# Altium schematic sheet NodemcuShield_Light_Temp_LCD.SchDoc
size A4
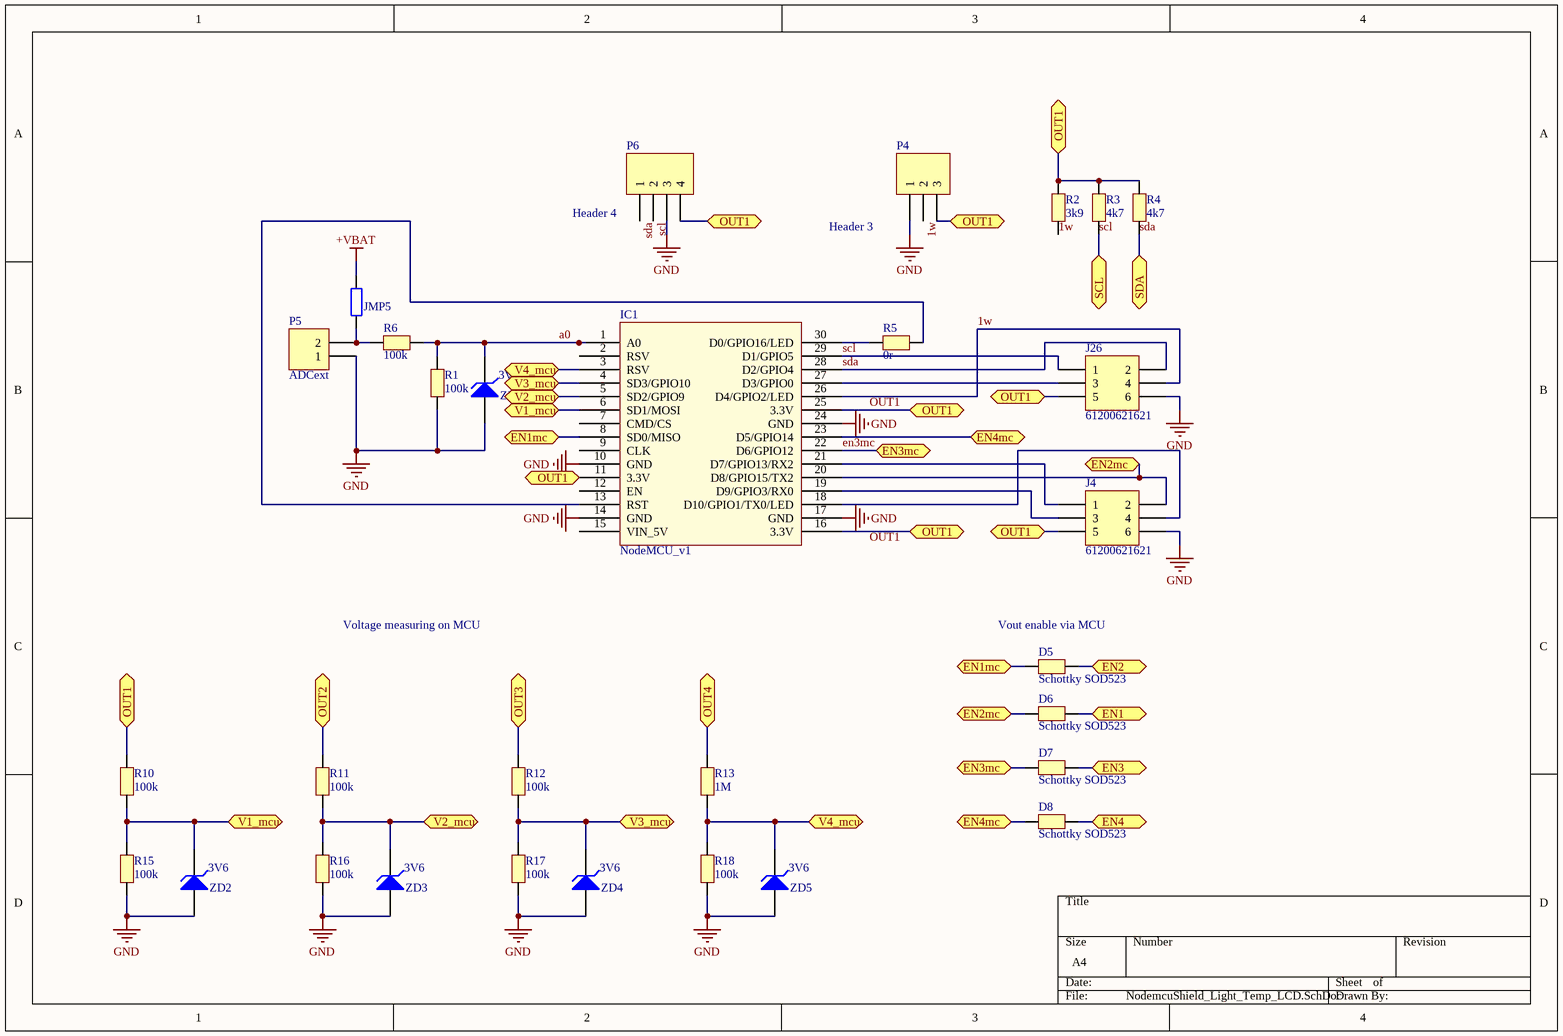
[diagram p0: NodemcuShield_Light_Temp_LCD.SchDoc]

## Parts
D5  Schottky SOD523  [SOD523]
D6  Schottky SOD523  [SOD523]
D7  Schottky SOD523  [SOD523]
D8  Schottky SOD523  [SOD523]
IC1  NodeMCU_v1  [Nodemcu]
J4  61200621621  [61200621621]
J26  61200621621  [61200621621]
JMP5  Resistor generic  [0603 RES]  (value not drawn)
P4  Header 3  [HDR1X3]
P5  ADCext  [HDR1X2]
P6  Header 4  [HDR1X4]
R1  100k  [0603 RES]
R2  3k9  [0603 RES]
R3  4k7  [0603 RES]
R4  4k7  [0603 RES]
R5  0r  [0603 RES]
R6  100k  [0603 RES]
R10  100k  [0603 RES]
R11  100k  [0603 RES]
R12  100k  [0603 RES]
R13  1M  [0603 RES]
R15  100k  [0603 RES]
R16  100k  [0603 RES]
R17  100k  [0603 RES]
R18  100k  [0603 RES]
ZD1  Valve: 3V6  [MELF_diode]  (hidden comment: Diode Zener)
ZD2  Valve: 3V6  [MELF_diode]  (hidden comment: Diode Zener)
ZD3  Valve: 3V6  [MELF_diode]  (hidden comment: Diode Zener)
ZD4  Valve: 3V6  [MELF_diode]  (hidden comment: Diode Zener)
ZD5  Valve: 3V6  [MELF_diode]  (hidden comment: Diode Zener)

## Ports
EN1, EN1mc, EN2, EN2mc, EN3, EN3mc, EN4, EN4mc, OUT1, OUT2, OUT3, OUT4, SCL, SDA, V1_mcu, V2_mcu, V3_mcu, V4_mcu

## Nets
+VBAT: JMP5.2
GND: IC1.10(GND) IC1.14(GND) IC1.17(GND) IC1.24(GND) J4.6 J26.6 P4.1 P5.1 P6.3 R1.2 R15.2 R16.2 R17.2 R18.2 ZD1.1(A) ZD2.1(A) ZD3.1(A) ZD4.1(A) ZD5.1(A)
1w: IC1.26(D4/GPIO2/LED) J26.4 P4.2 R2.1
a0: IC1.1(A0) R1.1 R6.1 ZD1.2(K)
EN1: D6.1 ; port EN1
EN1mc: D5.2 IC1.8(SD0/MISO) ; port EN1mc
EN2: D5.1 ; port EN2
EN2mc: D6.2 IC1.20(D8/GPIO15/TX2) J4.2 ; port EN2mc
EN3: D7.1 ; port EN3
en3mc: D7.2 IC1.22(D6/GPIO12) ; port EN3mc
EN4: D8.1 ; port EN4
EN4mc: D8.2 IC1.23(D5/GPIO14) ; port EN4mc
OUT1: IC1.11(3.3V) IC1.16(3.3V) IC1.25(3.3V) J4.5 J26.5 P4.3 P6.4 R2.2 R3.2 R4.2 R10.1 ; port OUT1
OUT2: R11.1 ; port OUT2
OUT3: R12.1 ; port OUT3
OUT4: R13.1 ; port OUT4
scl: IC1.29(D1/GPIO5) J26.1 P6.2 R3.1 ; port SCL
sda: IC1.28(D2/GPIO4) J26.2 P6.1 R4.1 ; port SDA
V1_mcu: IC1.6(SD1/MOSI) R10.2 R15.1 ZD2.2(K) ; port V1_mcu
V2_mcu: IC1.5(SD2/GPIO9) R11.2 R16.1 ZD3.2(K) ; port V2_mcu
V3_mcu: IC1.4(SD3/GPIO10) R12.2 R17.1 ZD4.2(K) ; port V3_mcu
V4_mcu: IC1.3(RSV) R13.2 R18.1 ZD5.2(K) ; port V4_mcu
NetIC1_13: IC1.13(RST) R5.1
NetIC1_18: IC1.18(D10/GPIO1/TX0/LED) J4.4
NetIC1_19: IC1.19(D9/GPIO3/RX0) J4.3
NetIC1_21: IC1.21(D7/GPIO13/RX2) J4.1
NetIC1_27: IC1.27(D3/GPIO0) J26.3
NetIC1_30: IC1.30(D0/GPIO16/LED) R5.2
NetJMP5_1: JMP5.1 P5.2 R6.2

Not connected (* = marked no-connect by the designer): IC1 2(RSV) 7(CMD/CS) 9(CLK) 12(EN) 15(VIN_5V)

## Notes on the sheet
- Voltage measuring on MCU
- (near D5) Vout enable via MCU
- Labels drawn without touching a wire or pin: OUT1

## Library data of the parts
D5-D8 = Resistor
IC1 = NodeMCU_v1: nodemcu
J4 J26 = 61200621621: WR-BHD 2.54mm Male Box Header; Manufacturer: Wurth Elektronik; ComponentLink1 Description: Manufacturer; ComponentLink2 Description: Datasheet; NoPins: 6; Created Date: March 2016; partNo: 61200621621; ComponentLink1URL: http://www.we-online.com; ComponentLink2URL: http://katalog.we-online.de/em/datasheet/6120xx21621.pdf; Created by: Baojun Chen
JMP5 = Resistor: Resistor SMD; Valve: *
P4 = Header 3: Header, 3-Pin; LatestRevisionDate: 17-Jul-2002; LatestRevisionNote: Re-released for DXP Platform.; Publisher: Altium Limited
P5 = Header 2: Header, 2-Pin; LatestRevisionDate: 17-Jul-2002; LatestRevisionNote: Re-released for DXP Platform.; Publisher: Altium Limited
P6 = Header 4: Header, 4-Pin; LatestRevisionDate: 17-Jul-2002; LatestRevisionNote: Re-released for DXP Platform.; Publisher: Altium Limited
R1-R6 = Resistor: Resistor 0603
R10-R13 R15-R18 = Resistor: Resistor 0805 smd
ZD1-ZD5 = Diode Zener: Zener